# EAGLE design pinguino_p8b3_RC2 (EAGLE 6.5.0)
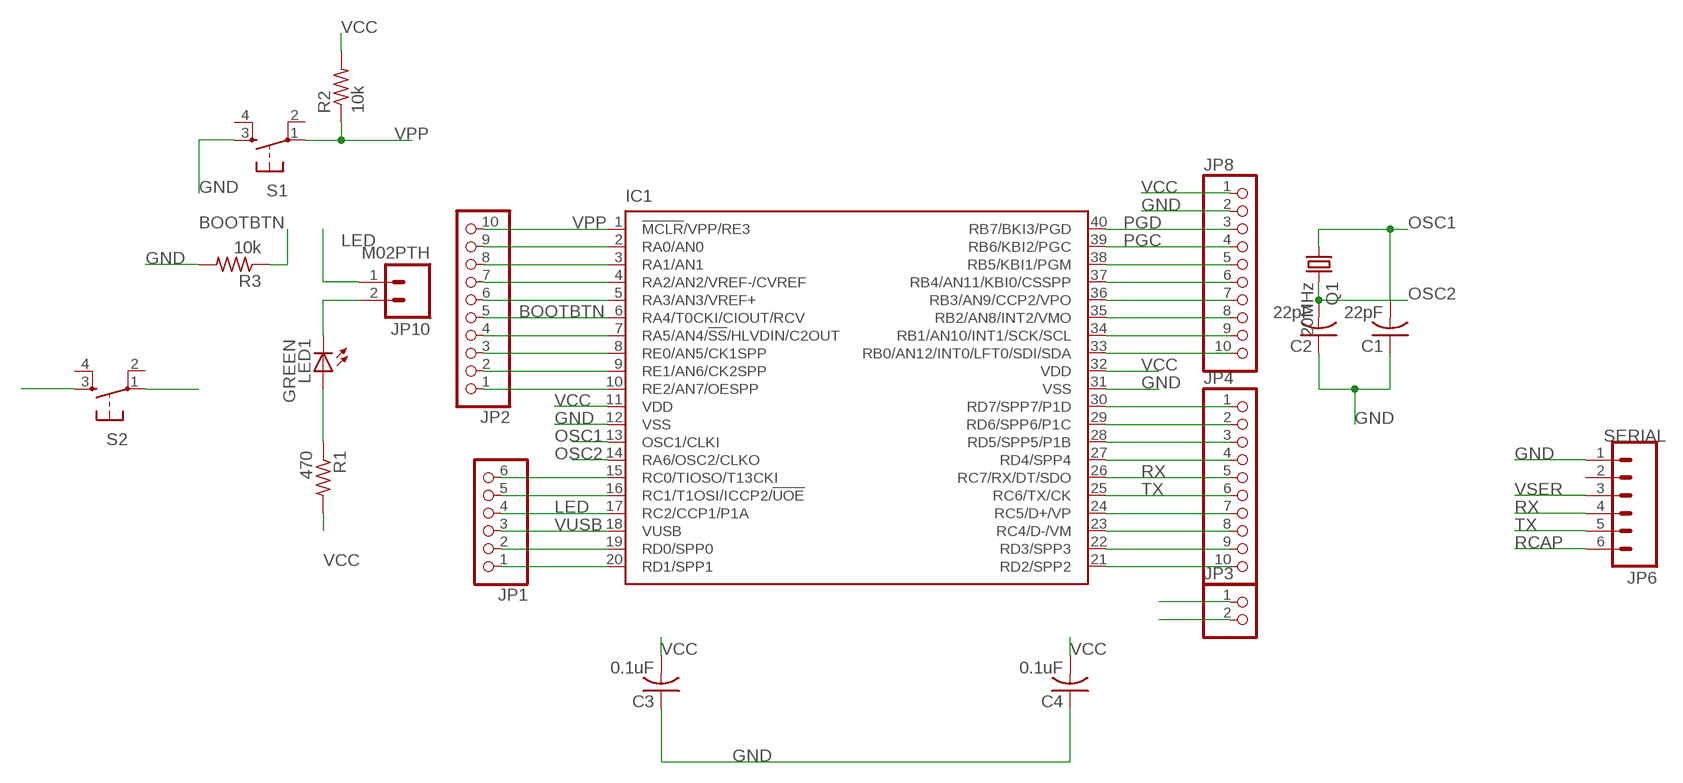
[diagram p0: schematic, sheet 1]

## Parts
C1  22pF  C-US025-025X050  [C025-025X050]
C2  22pF  C-US025-025X050  [C025-025X050]
C3  0.1uF  C-US025-025X050  [C025-025X050]
C4  0.1uF  C-US025-025X050  [C025-025X050]
IC1  PIC18F4550_40  [DIL40]
JP1  PINHD-1X6  [1X06]
JP2  PINHD-1X10  [1X10]
JP3  PINHD-1X2  [1X02]
JP4  PINHD-1X10  [1X10]
JP6  M06SIP  [1X06]
JP8  PINHD-1X10  [1X10]
JP10  M02PTH  [1X02]
LED1  GREEN  LED3MM  [LED3MM]
Q1  20MHz  CRYSTALHC49US  [HC49US]
R1  470  R-US_0207/10  [0207/10]
R2  10k  R-US_0207/7  [0207/7]
R3  10k  R-US_0207/7  [0207/7]
S1  TAC_SWITCHPTH  [TACTILE-PTH]
S2  TAC_SWITCHPTH  [TACTILE-PTH]

## Nets
BOOTBTN: IC1.6(RA4/T0CKI/CIOUT/RCV) JP2.5 R3.1 S2.1
GND: C1.1 C2.1 C3.1 C4.1 IC1.12(VSS) IC1.31(VSS) JP6.1 JP8.2 R3.2 S1.3
LED: IC1.17(RC2/CCP1/P1A) JP1.4 JP10.1
N$1: LED1.A R1.1
N$2: JP10.2 LED1.K(C)
N$3: IC1.38(RB5/KBI1/PGM) JP8.5
N$4: IC1.37(RB4/AN11/KBI0/CSSPP) JP8.6
N$5: IC1.36(RB3/AN9/CCP2/VPO) JP8.7
N$6: IC1.35(RB2/AN8/INT2/VMO) JP8.8
N$7: IC1.34(RB1/AN10/INT1/SCK/SCL) JP8.9
N$8: IC1.33(RB0/AN12/INT0/LFT0/SDI/SDA) JP8.10
N$9: IC1.30(RD7/SPP7/P1D) JP4.1
N$10: IC1.29(RD6/SPP6/P1C) JP4.2
N$11: IC1.28(RD5/SPP5/P1B) JP4.3
N$12: IC1.27(RD4/SPP4) JP4.4
N$14: IC1.24(RC5/D+/VP) JP4.7
N$15: IC1.23(RC4/D-/VM) JP4.8
N$16: IC1.22(RD3/SPP3) JP4.9
N$17: IC1.15(RC0/TIOSO/T13CKI) JP1.6
N$18: IC1.16(RC1/T1OSI/ICCP2/!UOE) JP1.5
N$19: IC1.21(RD2/SPP2) JP4.10
N$20: IC1.19(RD0/SPP0) JP1.2
N$21: IC1.20(RD1/SPP1) JP1.1
N$22: IC1.2(RA0/AN0) JP2.9
N$23: IC1.3(RA1/AN1) JP2.8
N$24: IC1.4(RA2/AN2/VREF-/CVREF) JP2.7
N$25: IC1.5(RA3/AN3/VREF+) JP2.6
N$27: IC1.7(RA5/AN4/!SS!/HLVDIN/C2OUT) JP2.4
N$28: IC1.8(RE0/AN5/CK1SPP) JP2.3
N$29: IC1.9(RE1/AN6/CK2SPP) JP2.2
N$30: IC1.10(RE2/AN7/OESPP) JP2.1
OSC1: C1.2 IC1.13(OSC1/CLKI) Q1.1
OSC2: C2.2 IC1.14(RA6/OSC2/CLKO) Q1.2
PGC: IC1.39(RB6/KBI2/PGC) JP8.4
PGD: IC1.40(RB7/BKI3/PGD) JP8.3
RCAP: JP6.6
RX: IC1.26(RC7/RX/DT/SDO) JP4.5 JP6.4
TX: IC1.25(RC6/TX/CK) JP4.6 JP6.5
VCC: C3.2 C4.2 IC1.11(VDD) IC1.32(VDD) JP3.1 JP8.1 R1.2 R2.2 S2.3
VPP: IC1.1(!MCLR!/VPP/RE3) JP2.10 R2.1 S1.1
VSER: JP3.2 JP6.3
VUSB: IC1.18(VUSB) JP1.3
Unconnected: JP6.2 S1.2 S1.4 S2.2 S2.4

## Notes on the sheet
- SERIAL

## Library data of the parts
C1-C4 = rcl:C-US: CAPACITOR, American symbol
IC1 = microchip:PIC18F4*_40: USB Microcontrollers with nanoWatt Technology High-Performance, Enhanced Flash, 28/40/44-Pin, Source: http://ww1.microchip.com/downloads/en/devicedoc/39632c.pdf
JP1 = pinhead:PINHD-1X6: PIN HEADER
JP2 JP4 JP8 = pinhead:PINHD-1X10: PIN HEADER
JP3 = pinhead:PINHD-1X2: PIN HEADER
JP6 = SparkFun:M06: Header 6 Standard 6-pin 0.1" header. Use with straight break away headers (SKU : PRT-00116), right angle break away headers (PRT-00553), swiss pins (PRT-00743), machine pins (PRT-00117), and female headers (PRT-00115). Molex polarized connector foot print use with SKU : PRT-08094 with associated crimp pins and housings. NOTES ON THE VARIANTS LOCK and LOCK_LONGPADS... This footprint was designed to help hold the alignment of a through-hole component (i.e. 6-pin header) while soldering it into place. You may notice that each hole has been shifted either up or down by 0.005 of an inch from it's more standard position (which is a perfectly straight line). This slight alteration caused the pins (the squares in the middle) to touch the edges of the holes. Because they are alternating, it causes a "brace" to hold the component in place. 0.005 has proven to be the perfect amount of "off-center" position when using our standard breakaway headers. Although looks a little odd when you look at the bare footprint, once you have a header in there, the alteration is very hard to notice. Also, if you push a header all the way into place, it is covered up entirely on the bottom side. This idea of altering the position of holes to aid alignment will be further integrated into the Sparkfun Library for other footprints. It can help hold any component with 3 or more connection pins.
JP10 = SparkFun-Connectors:M02: Standard 2-pin 0.1" header. Use with - straight break away headers ( PRT-00116) - right angle break away headers (PRT-00553) - swiss pins (PRT-00743) - machine pins (PRT-00117) - female headers (PRT-00115) Molex polarized connector foot print use with: PRT-08233 with associated crimp pins and housings. 2.54_SCREWTERM for use with PRT-10571. 3.5mm Screw Terminal footprints for PRT-08084 5mm Screw Terminal footprints for use with PRT-08433
LED1 = SparkFun:LED: LEDs Standard schematic elements and footprints for 5mm, 3mm, 1206, and 0603 sized LEDs. 5mm - Spark Fun Electronics SKU : COM-00529 (and others)
Q1 = SparkFun:CRYSTAL: Crystals Various standard crystals. Proven footprints. Spark Fun Electronics SKU : COM-00534
R1-R3 = rcl:R-US_: RESISTOR, American symbol
S1 S2 = SparkFun-Electromechanical:TAC_SWITCH: Momentary Switch Button commonly used for reset or general input. Spark Fun Electronics SKU : COM-00097 SMT- SWCH-08247

## Board
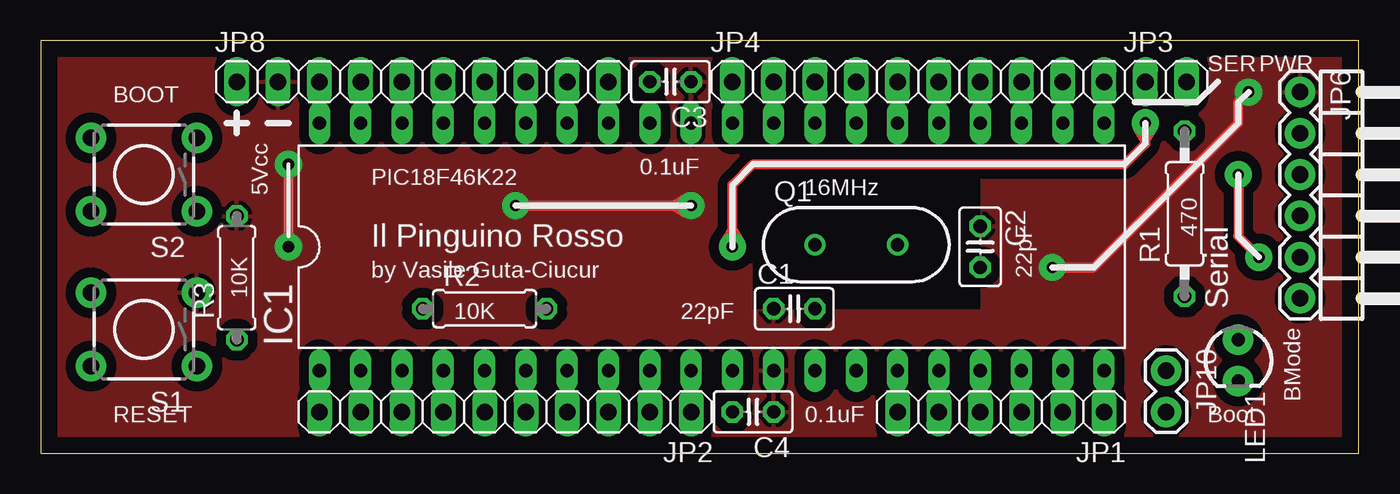
[diagram p1: board, top side]
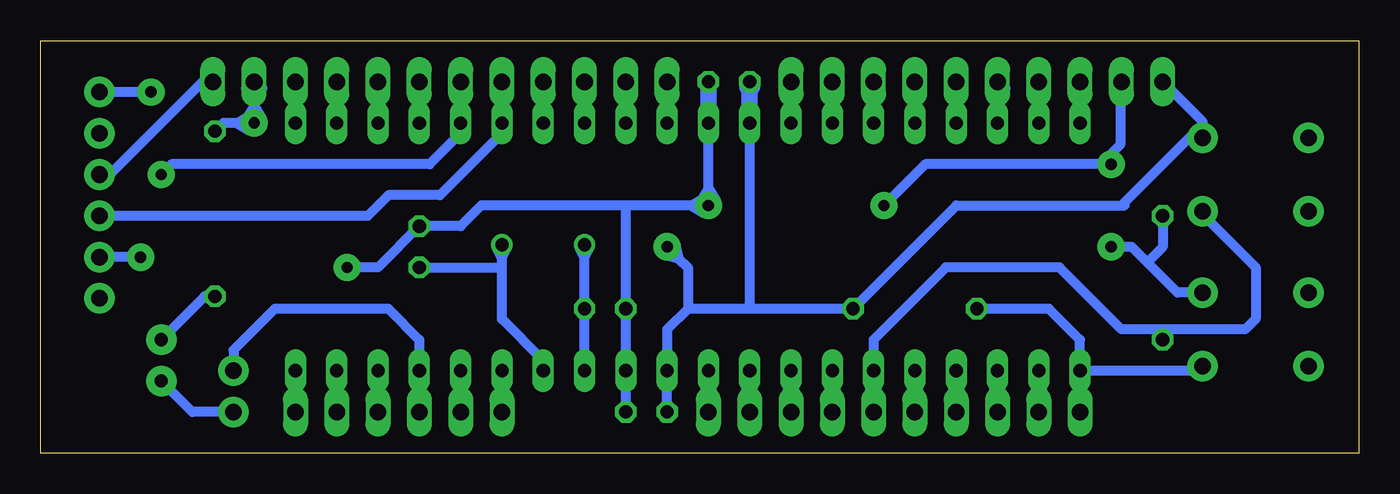
[diagram p2: board, bottom side, seen from below]

Size 81.08 x 25.39 mm. Coordinates in mm from the lower left corner, seen from the top.
Outline: 0,0 81.08,0 81.08,25.39 0,25.39 0,0
Copper layers (1*16): Top 0.035mm / dielectric 1.5mm / Bottom 0.035mm
Design rules "default *": minimum track width 10mil, minimum drill 24mil, track to track 24mil, track to pad 24mil, pad to pad 24mil, via to via 24mil, smd to smd 8mil, copper to edge 40mil, drill to drill 8mil, minimum pad ring 10mil, minimum via ring 8mil, stop-mask expansion 4mil, vias tented up to drill 0mil, thermal gap 10mil
tRestrict: area 43.8,8.9 to 57.8,17.1

### Footprints (pad centres in the part's own frame; a part is rotated, then mirrored left to right if it is on the bottom)
C025-025X050 = drill 0.813 octagon: 1 -1.27,0; 2 1.27,0
DIL40 = drill 0.813 long: 1 -24.13,-7.62; 2 -21.59,-7.62; 3 -19.05,-7.62; 4 -16.51,-7.62; 5 -13.97,-7.62; 6 -11.43,-7.62; 7 -8.89,-7.62; 8 -6.35,-7.62; 9 -3.81,-7.62; 10 -1.27,-7.62; 11 1.27,-7.62; 12 3.81,-7.62; 13 6.35,-7.62; 14 8.89,-7.62; 15 11.43,-7.62; 16 13.97,-7.62; 17 16.51,-7.62; 18 19.05,-7.62; 19 21.59,-7.62; 20 24.13,-7.62; 21 24.13,7.62; 22 21.59,7.62; 23 19.05,7.62; 24 16.51,7.62; 25 13.97,7.62; 26 11.43,7.62; 27 8.89,7.62; 28 6.35,7.62; 29 3.81,7.62; 30 1.27,7.62; 31 -1.27,7.62; 32 -3.81,7.62; 33 -6.35,7.62; 34 -8.89,7.62; 35 -11.43,7.62; 36 -13.97,7.62; 37 -16.51,7.62; 38 -19.05,7.62; 39 -21.59,7.62; 40 -24.13,7.62
1X06 = drill 1.016 long: 1 -6.35,0; 2 -3.81,0; 3 -1.27,0; 4 1.27,0; 5 3.81,0; 6 6.35,0
1X10 = drill 1.016 long: 1 -11.43,0; 2 -8.89,0; 3 -6.35,0; 4 -3.81,0; 5 -1.27,0; 6 1.27,0; 7 3.81,0; 8 6.35,0; 9 8.89,0; 10 11.43,0
1X02 = drill 1.016 long: 1 -1.27,0; 2 1.27,0
1X06' = drill 1.016 pad 1.88: 1 0,0; 2 2.54,0; 3 5.08,0; 4 7.62,0; 5 10.16,0; 6 12.7,0
1X02' = drill 1.016 pad 1.88: 1 -1.27,0; 2 1.27,0
LED3MM = drill 0.813 pad 1.88: A -1.27,0; K 1.27,0
HC49US = drill 0.813: 1 -2.54,0; 2 2.54,0
0207/10 = drill 0.813 octagon: 1 -5.08,0; 2 5.08,0
0207/7 = drill 0.813 octagon: 1 -3.81,0; 2 3.81,0
TACTILE-PTH = drill 1.016 pad 1.88: 1 -3.251,2.261; 2 3.251,2.261; 3 -3.251,-2.261; 4 3.251,-2.261

### Placement (x,y rotation side)
C1  46.35,8.89 0 top
C2  57.78,12.7 270 top
C3  38.73,22.86 180 top
C4  43.81,2.54 180 top
IC1  41.27,12.7 0 top
JP1  59.05,2.54 180 top
JP2  28.57,2.54 180 top
JP3  69.22,22.86 0 top
JP4  53.98,22.86 0 top
JP6  [1X06']  77.47,22.23 270 top
JP8  23.5,22.86 0 top
JP10  M02PTH  [1X02']  69.22,3.81 270 top
LED1  73.66,5.71 270 top
Q1  50.16,12.83 0 top
R1  70.36,14.73 90 top
R2  27.3,8.89 0 top
R3  12.06,10.79 90 top
S1  6.35,7.62 180 top
S2  6.35,17.14 180 top

### Tracks (layer width: path | path; a pad name or v marks a point on that pad's centre or on a via)
BOOTBTN
  Bottom 0.61: IC1.6 29.84,6.99 25.4,11.43 18.41,11.43 14.61,7.62 12.06,7.62 | S2.1 9.6,14.68 6.35,11.43 6.35,8.26 6.99,7.62 12.06,7.62 | R3.1 12.06,7.62
  Bottom 1.016: IC1.6 JP2.5
GND  (via drill 0.7 pad 1.68)
  Top 0.61: v29.21,15.24 38.95,15.24 | 38.95,15.24 v40.01,15.24 | 38.95,15.24 39.73,14.78 v40.01,15.24 | 38.95,15.24 39.73,15.7 v40.01,15.24 | v15.24,12.7 v15.24,17.78 | v62.23,11.43 64.77,11.43 73.66,20.32 73.66,21.59 v74.3,22.23
  Bottom 0.61: v40.01,15.24 41.05,15.24 | 41.05,15.24 45.09,15.24 | v40.01,15.24 40.01,16.29 | 40.01,16.29 IC1.31 | 45.09,15.24 53.98,15.24 55.24,13.97 C2.1 60.33,11.43 v62.23,11.43 | 41.05,15.24 40.28,15.7 v40.01,15.24 | 41.05,15.24 40.28,14.78 v40.01,15.24 | 40.01,16.29 39.55,15.51 v40.01,15.24 | 40.01,16.29 40.46,15.51 v40.01,15.24 | 14.61,22.3 JP8.2 14.68,22.23 14.68,18.98 15.56,18.1 | C4.1 IC1.12 C1.1 45.09,15.24 | 15.56,18.1 15.88,17.78 26.67,17.78 v29.21,15.24 | v15.24,17.78 15.56,18.1 | v15.24,12.7 13.97,12.7 13.02,11.75 | S1.3 11.15,9.88 13.02,11.75 | R3.2 12.06,12.7 13.02,11.75 | v74.3,22.23 JP6.1
  Bottom 1.016: IC1.31 C3.1
  pour Top: -1.27,26.04 82.55,26.04 82.55,-1.27 -1.27,-1.27
LED
  Bottom 0.61: JP1.4 IC1.17 57.78,6.99 59.69,8.89 66.67,8.89 69.22,6.35 JP10.1
N$1
  Bottom 0.61: R1.1 70.99,9.65 LED1.A
N$2
  Bottom 0.61: JP10.2 71.75,2.54 LED1.K
N$3
  Bottom 0.61: 22.23,21.84 IC1.38 JP8.5 | 22.23,21.84 22.72,22.46 | 22.23,21.84 21.73,22.46
N$4
  Bottom 0.61: JP8.6 IC1.37
N$5
  Bottom 0.61: JP8.7 IC1.36
N$6
  Bottom 0.61: JP8.8 IC1.35
N$7
  Bottom 0.61: JP8.9 IC1.34
N$8
  Bottom 0.61: JP8.10 IC1.33
N$9
  Bottom 0.61: IC1.30 JP4.1
N$10
  Bottom 0.61: IC1.29 JP4.2
N$11
  Bottom 0.61: IC1.28 JP4.3
N$12
  Bottom 0.61: IC1.27 JP4.4
N$14
  Bottom 0.61: IC1.24 JP4.7
N$15
  Bottom 0.61: IC1.23 JP4.8
N$16
  Bottom 0.61: IC1.22 JP4.9
N$17
  Bottom 0.61: JP1.6 IC1.15
N$18
  Bottom 0.61: IC1.16 JP1.5
N$19
  Bottom 0.61: JP4.10 IC1.21
N$20
  Bottom 0.61: JP1.2 IC1.19
N$21
  Bottom 0.61: JP1.1 IC1.20
N$22
  Bottom 1.016: IC1.2 JP2.9
N$23
  Bottom 1.016: IC1.3 JP2.8
N$24
  Bottom 1.016: IC1.4 JP2.7
N$25
  Bottom 1.016: IC1.5 JP2.6
N$27
  Bottom 1.016: IC1.7 JP2.4
N$28
  Bottom 1.016: IC1.8 JP2.3
N$29
  Bottom 1.016: IC1.9 JP2.2
N$30
  Bottom 1.016: IC1.10 JP2.1
OSC1
  Bottom 0.61: 47.62,12.01 47.95,12.67 Q1.1 | 47.62,12.01 47.3,12.67 Q1.1 | IC1.13 C1.2 47.62,12.01 | 47.62,12.01 Q1.1
OSC2
  Bottom 0.61: 52.7,12.01 53.02,12.67 Q1.2 | 52.7,12.01 52.38,12.67 Q1.2 | IC1.14 50.16,5.71 52.7,8.26 52.7,11.43 | 52.7,11.43 52.7,12.01 | 52.7,12.01 Q1.2 | C2.2 52.7,11.43
PGC
  Bottom 0.61: JP8.4 IC1.39
PGD
  Bottom 0.61: JP8.3 IC1.40
RX
  Bottom 0.61: JP4.5 IC1.26 52.7,19.68 56.52,15.88 59.69,15.88 60.96,14.61 JP6.4
TX  (via drill 0.7 pad 1.68)
  Top 0.61: v73.66,17.14 73.66,13.34 v74.93,12.06
  Bottom 0.61: JP4.6 IC1.25 55.24,19.68 57.15,17.78 73.03,17.78 v73.66,17.14 | v74.93,12.06 JP6.5
VCC  (via drill 0.7 pad 1.68)
  Top 0.61: 67.94,19.27 67.94,19.05 66.67,17.78 43.81,17.78 42.55,16.51 42.55,13.75 | 67.94,19.27 v67.94,20.32 | v42.55,12.7 42.55,13.75 | 67.94,19.27 68.4,20.05 v67.94,20.32 | 67.94,19.27 67.49,20.05 v67.94,20.32 | 42.55,13.75 42.09,12.97 v42.55,12.7 | 42.55,13.75 43,12.97 v42.55,12.7
  Bottom 0.61: v67.94,20.32 67.94,21.37 | 67.94,21.37 67.94,21.84 | 41.8,11.96 41.27,11.43 41.27,8.89 | 41.8,11.96 v42.55,12.7 | v67.94,20.32 69,20.32 | 69,20.32 69.85,20.32 R1.2 | 67.94,21.37 67.49,20.59 v67.94,20.32 | 67.94,21.37 68.4,20.59 v67.94,20.32 | 69,20.32 68.22,20.78 v67.94,20.32 | 69,20.32 68.22,19.86 v67.94,20.32 | 41.8,11.96 42.68,12.18 v42.55,12.7 | 41.8,11.96 42.03,12.83 v42.55,12.7 | 37.47,22.16 37.81,22.47 C3.2 37.12,22.47 37.47,22.16 | 67.94,21.84 68.44,22.46 | 67.94,21.84 67.45,22.46 | C4.2 IC1.11 42.55,7.62 41.27,8.89 | JP3.1 67.94,21.84 | 37.47,8.89 R2.2 24.77,15.24 14.4,15.24 14.4,15.44 10.16,19.68 9.88,19.68 S2.3 9.6,20.4 JP8.1 | 37.47,8.89 41.27,8.89 | 37.47,22.16 37.47,8.89
  Bottom 1.016: C3.2 37.47,22.16 IC1.32
VPP
  Bottom 0.61: R2.1 19.05,8.89 17.14,6.99 IC1.1 | IC1.1 9.88,5.08 S1.1 | JP2.10 IC1.1
VSER
  Bottom 0.61: JP6.3 76.83,17.14 71.12,22.86 JP3.2
VUSB
  Bottom 0.61: JP1.3 IC1.18

### Text on the board
tPlace: SER | PWR | BOOT | PIC18F46K22 | 0.1uF | 5Vcc | 16MHz | Il Pinguino Rosso | 470 | by Vasile Guta-Ciucur | 22pF | 10K | Serial | 10K | 22pF | BMode | RESET | 0.1uF | Boot
Document: VPP | +5Vcc | GND | RB7 | RB6 | RB5 | RB4 | RB3 | RB2 | RB1/SCL | RB0/SDA | RD7 | RD6 | RD5 | RD4 | RC7/RX | RC6/TX | RD3 | RD2 | RA0 | RA1 | RA2 | RA3 | RA4 | RA5 | RE0 | RE1 | RE2 | RC0 | RC1 | RC2 | RD0 | RD1